# Altium schematic sheet Three_Phase_Rectifier_Regulator.SchDoc
size A4; Organization: Altium Limited; Address1: L3, 12a Rodborough Rd; Address2: Frenchs Forest; Address3: NSW; Address4: Australia 2086
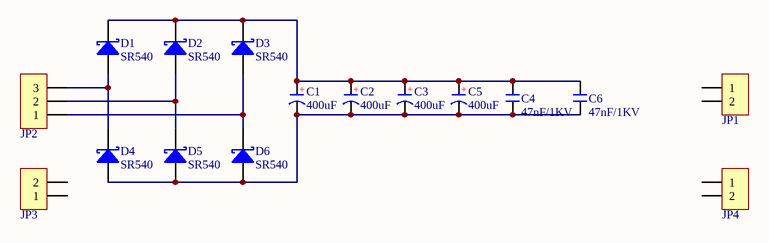
[diagram p0: Three_Phase_Rectifier_Regulator.SchDoc]

## Parts
C1  400uF  [CAP 7.5*16*25 - GD]
C2  400uF  [CAP 7.5*16*25 - GD]
C3  400uF  [CAP 7.5*16*25 - GD]
C4  47nF/1KV  [CY 7.5*12*5]
C5  400uF  [CAP 7.5*16*25 - GD]
C6  47nF/1KV  [CY 7.5*12*5]
D1  SR540  [DO-27]
D2  SR540  [DO-27]
D3  SR540  [DO-27]
D4  SR540  [DO-27]
D5  SR540  [DO-27]
D6  SR540  [DO-27]
JP1  HDR-1X2  [KF7620-2P]  (value not drawn)
JP2  HDR-1X3  [KF7620-3P]  (value not drawn)
JP3  HDR-1X2  [KF7620-2P]  (value not drawn)
JP4  HDR-1X2  [KF7620-2P]  (value not drawn)

## Nets
NetC1_1: C1.1(A) C2.1(A) C3.1(A) C4.2 C5.1(A) C6.2 D1.2(K) D2.2(K) D3.2(K)
NetC1_2: C1.2(K) C2.2(K) C3.2(K) C4.1 C5.2(K) C6.1 D4.1(A) D5.1(A) D6.1(A)
NetD1_1: D1.1(A) D4.2(K) JP2.3
NetD2_1: D2.1(A) D5.2(K) JP2.2
NetD3_1: D3.1(A) D6.2(K) JP2.1

Not connected (* = marked no-connect by the designer): JP1 1 2; JP3 1 2; JP4 1 2

## Notes on the sheet
- Title
- Size:
- Date:
- A4
- Number:
- Time:
- Revision:
- Sheet
- of
- File:
- (in symbol CE) +

## Library data of the parts
C1-C3 C5 = CE: 直插电解电容; 淘宝ID: 小糖豆的小窝窝; BOM名称: 直插电解电容; 下单链接: https://item.taobao.com/item.htm?ft=t&id=613637044352
C4 C6 = CY: 安规Y电容; 淘宝ID: 小糖豆的小窝窝; BOM名称: 安规Y电容; 下单链接: https://item.taobao.com/item.htm?ft=t&id=613637044352
D1-D6 = SR540: 肖特基二极管; BOM名称: 肖特基二极管; 下单链接: https://item.taobao.com/item.htm?ft=t&id=613637044352
JP1 JP3 JP4 = Header 2: 2P接插件; 淘宝ID: 小糖豆的小窝窝; BOM名称: 2P接插件; 下单链接: https://item.taobao.com/item.htm?ft=t&id=613637044352
JP2 = Header 3: 3P接插件; 淘宝ID: 小糖豆的小窝窝; BOM名称: 3P接插件; 下单链接: https://item.taobao.com/item.htm?ft=t&id=613637044352